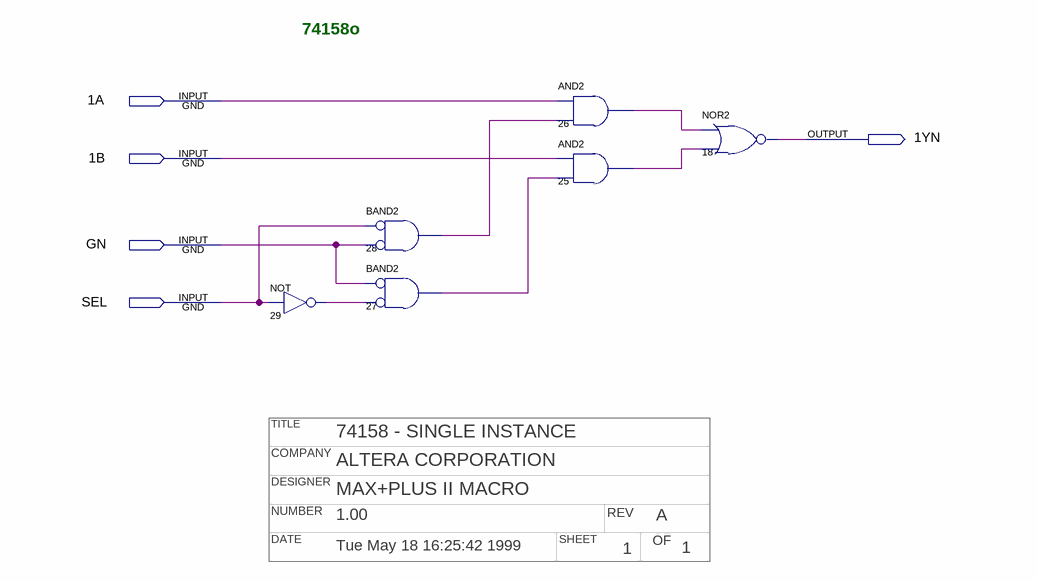
[diagram p0: schematic sheet]
// Quartus schematic 74158o.bdf as structural Verilog: 6 symbols, 5 pins
// Title block: TITLE: 74158 - SINGLE INSTANCE; COMPANY: ALTERA CORPORATION; DESIGNER: MAX+PLUS II MACRO; NUMBER: 1.00; REV: A; DATE: Tue May 18 16:25:42 1999; SHEET: 1; OF: 1
module \74158o  (
  input  \1A ,
  input  \1B ,
  input  GN,
  input  SEL,
  output \1YN 
);

  wire n25_out, n26_out, n27_out, n28_out, n29_out;

  not u_29 (n29_out, SEL);
  and u_28 (n28_out, ~SEL, ~GN);  // BAND2
  and u_27 (n27_out, ~GN, ~n29_out);  // BAND2
  and u_26 (n26_out, \1A , n28_out);
  and u_25 (n25_out, \1B , n27_out);
  nor u_18 (\1YN , n26_out, n25_out);

  // Notes on the sheet:
  //   74158o
endmodule
